# Altium schematic sheet pca10171_interface_mcu.SchDoc: =BoardTitle + ' - Interface MCU'
size A3; Organization: Nordic Semiconductor; DocumentNumber: 3; SheetNumber: 3; SheetTotal: 10; CompanyName: Nordic Semiconductor; DocumentSize: A3
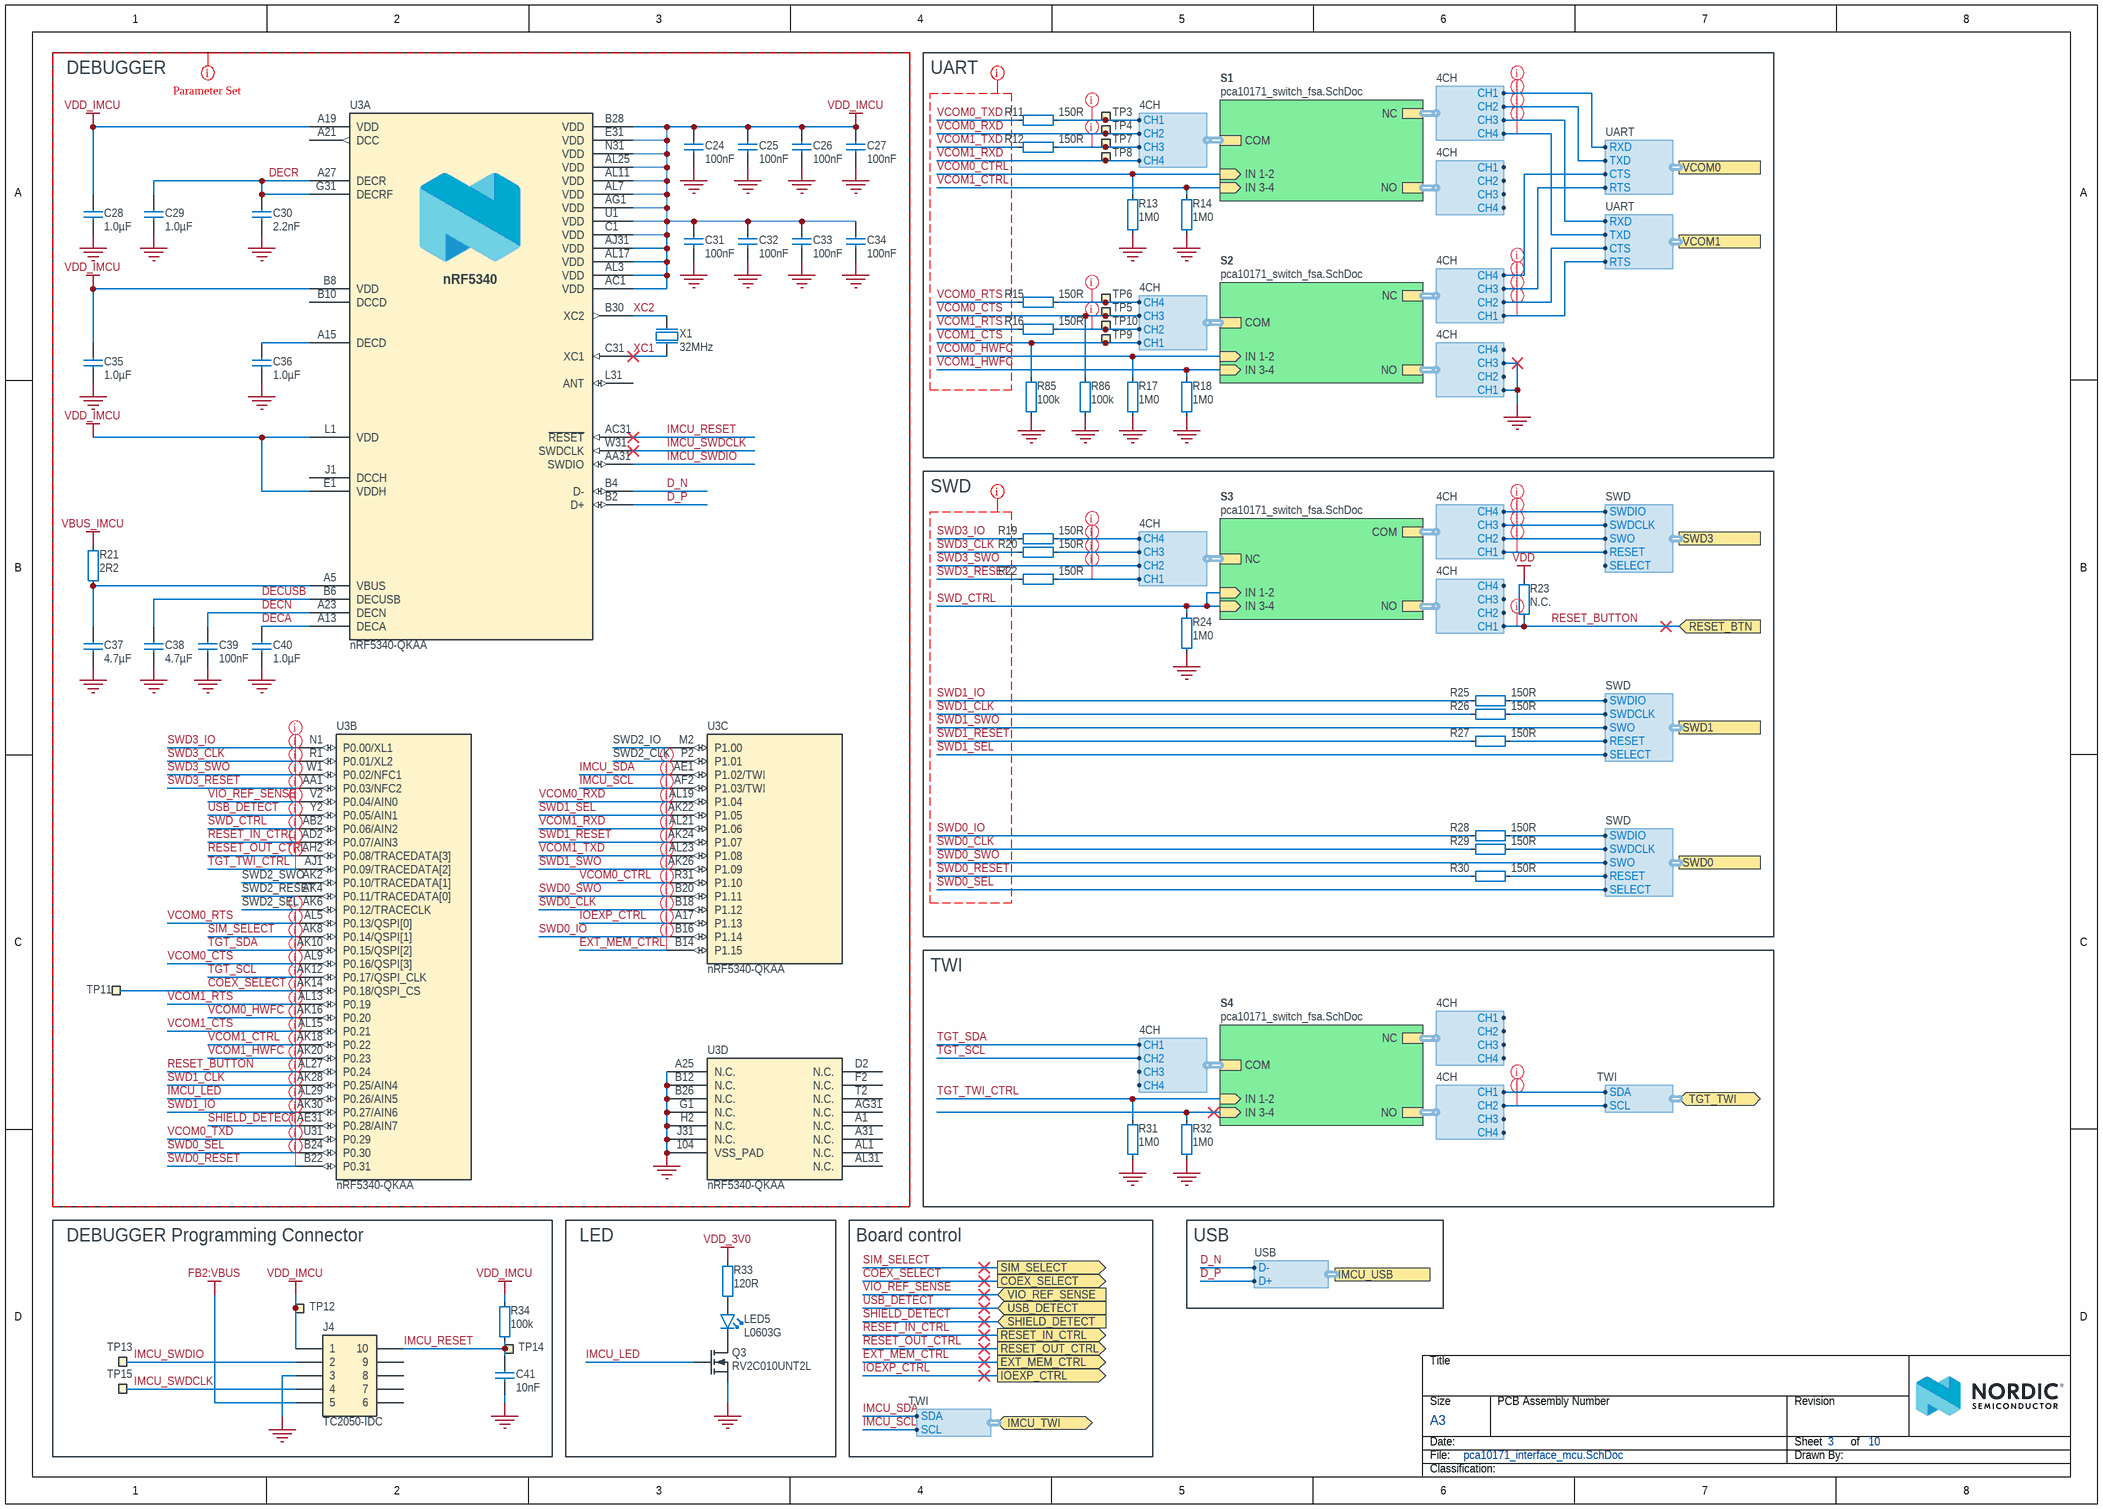
[diagram p0: pca10171_interface_mcu.SchDoc]

## Parts
C24  100nF  [CAPC0603X03L_C]
C25  100nF  [CAPC0603X03L_C]
C26  100nF  [CAPC0603X03L_C]
C27  100nF  [CAPC0603X03L_C]
C28  1.0µF  [CAPC1005X04L]
C29  1.0µF  [CAPC1005X04L]
C30  2.2nF  [CAPC0603X03L_C]
C31  100nF  [CAPC0603X03L_C]
C32  100nF  [CAPC0603X03L_C]
C33  100nF  [CAPC0603X03L_C]
C34  100nF  [CAPC0603X03L_C]
C35  1.0µF  [CAPC1005X04L]
C36  1.0µF  [CAPC1005X04L]
C37  4.7µF  [CAPC1608X06L]
C38  4.7µF  [CAPC1608X06L]
C39  100nF  [CAPC0603X03L_C]
C40  1.0µF  [CAPC1005X04L]
C41  10nF  [CAPC0603X03L_C]
J4  TC2050-IDC  [TC2050-IDC-NLFP]  (no BOM)
LED5  L0603G  [LED_0603_G]
Q3  RV2C010UNT2L  [DFN65P100X40-3L]
R11  150R  [RESC0603X03L_C]
R12  150R  [RESC0603X03L_C]
R13  1M0  [RESC0603X03L_C]
R14  1M0  [RESC0603X03L_C]
R15  150R  [RESC0603X03L_C]
R16  150R  [RESC0603X03L_C]
R17  1M0  [RESC0603X03L_C]
R18  1M0  [RESC0603X03L_C]
R19  150R  [RESC0603X03L_C]
R20  150R  [RESC0603X03L_C]
R21  2R2  [RESC0603X03L_C]
R22  150R  [RESC0603X03L_C]
R23  N.C.  [RESC0603X03L_C_NC]
R24  1M0  [RESC0603X03L_C]
R25  150R  [RESC0603X03L_C]
R26  150R  [RESC0603X03L_C]
R27  150R  [RESC0603X03L_C]
R28  150R  [RESC0603X03L_C]
R29  150R  [RESC0603X03L_C]
R30  150R  [RESC0603X03L_C]
R31  1M0  [RESC0603X03L_C]
R32  1M0  [RESC0603X03L_C]
R33  120R  [RESC0603X03L_C]
R34  100k  [RESC0603X03L_C]
R85  100k  [RESC0603X03L_C]
R86  100k  [RESC0603X03L_C]
TP3  Ø1.5mm,SMD  [TP_SMD_D1.5mm]  (value not drawn)  (no BOM)
TP4  Ø1.5mm,SMD  [TP_SMD_D1.5mm]  (value not drawn)  (no BOM)
TP5  Ø1.5mm,SMD  [TP_SMD_D1.5mm]  (value not drawn)  (no BOM)
TP6  Ø1.5mm,SMD  [TP_SMD_D1.5mm]  (value not drawn)  (no BOM)
TP7  Ø1.5mm,SMD  [TP_SMD_D1.5mm]  (value not drawn)  (no BOM)
TP8  Ø1.5mm,SMD  [TP_SMD_D1.5mm]  (value not drawn)  (no BOM)
TP9  Ø1.5mm,SMD  [TP_SMD_D1.5mm]  (value not drawn)  (no BOM)
TP10  Ø1.5mm,SMD  [TP_SMD_D1.5mm]  (value not drawn)  (no BOM)
TP11  Ø1.5mm,SMD  [TP_SMD_D1.5mm]  (value not drawn)  (no BOM)
TP12  Ø1.5mm,SMD  [TP_SMD_D1.5mm]  (value not drawn)  (no BOM)
TP13  Ø1.5mm,SMD  [TP_SMD_D1.5mm]  (value not drawn)  (no BOM)
TP14  Ø1.5mm,SMD  [TP_SMD_D1.5mm]  (value not drawn)  (no BOM)
TP15  Ø1.5mm,SMD  [TP_SMD_D1.5mm]  (value not drawn)  (no BOM)
U3  nRF5340-QKAA  [AQFN40P700X700X85_HS-99N]  (parts A,B,C,D of 4)
X1  32MHz  [BT-XTAL_2016]

## Blocks framed on the sheet
DEBUGGER: C24-C40 R21 TP11 U3 X1
UART: R11-R18 R85 R86 TP3-TP10
SWD: R19 R20 R22-R30
TWI: R31 R32
DEBUGGER Programming Connector: C41 J4 R34 TP12-TP15
LED: LED5 Q3 R33

## Sub-sheets
S1 = pca10171_switch_fsa.SchDoc: IN 1-2 (in), COM (harness 4CH), NC (harness 4CH), NO (harness 4CH), IN 3-4 (in)
S2 = pca10171_switch_fsa.SchDoc: IN 1-2 (in), COM (harness 4CH), NC (harness 4CH), NO (harness 4CH), IN 3-4 (in)
S3 = pca10171_switch_fsa.SchDoc: IN 1-2 (in), COM (harness 4CH), NC (harness 4CH), NO (harness 4CH), IN 3-4 (in)
S4 = pca10171_switch_fsa.SchDoc: IN 1-2 (in), COM (harness 4CH), NC (harness 4CH), NO (harness 4CH), IN 3-4 (in)

## Ports
COEX_SELECT (out), EXT_MEM_CTRL (out), IMCU_TWI (bidir, harness TWI), IMCU_USB (harness USB), IOEXP_CTRL (out), RESET_BTN (in), RESET_IN_CTRL (out), RESET_OUT_CTRL (out), SHIELD_DETECT (in), SIM_SELECT (out), SWD0 (harness SWD), SWD1 (harness SWD), SWD3 (harness SWD), TGT_TWI (bidir, harness TWI), USB_DETECT (in), VCOM0 (harness UART), VCOM1 (harness UART), VIO_REF_SENSE (in)

## Harnesses
TWI: SCL, SDA
SWD: SWDIO, SWDCLK, SWO, RESET, SELECT
USB: D+, D-
4CH: CH1, CH2, CH3, CH4
UART: RTS, CTS, RXD, TXD

## Nets
FB2:VBUS: J4.5
GND: C24.1 C25.1 C26.2 C27.1 C28.2 C29.1 C30.2 C31.1 C32.1 C33.1 C34.2 C35.1 C36.1 C37.2 C38.2 C39.2 C40.1 C41.1 J4.3 Q3.2(S) R13.2 R14.1 R17.2 R18.1 R24.1 R31.2 R32.1 R85.2 R86.2 U3.104(VSS_PAD) U3.A25(N.C.) U3.B12(N.C.) U3.B26(N.C.) U3.G1(N.C.) U3.H2(N.C.) U3.J31(N.C.) X1.2(GND) X1.4(GND) ; sheet S2/NO.CH1, sheet S2/NO.CH3
VBUS_IMCU: R21.1
VDD: R23.2
VDD_3V0: R33.2
VDD_IMCU: C24.2 C25.2 C26.1 C27.2 C28.1 C31.2 C32.2 C33.2 C34.1 C35.2 J4.1 R34.2 TP12.1 U3.A19(VDD) U3.AC1(VDD) U3.AG1(VDD) U3.AJ31(VDD) U3.AL3(VDD) U3.AL7(VDD) U3.AL11(VDD) U3.AL17(VDD) U3.AL25(VDD) U3.B8(VDD) U3.B28(VDD) U3.C1(VDD) U3.E1(VDDH) U3.E31(VDD) U3.L1(VDD) U3.N31(VDD) U3.U1(VDD)
COEX_SELECT: TP11.1 U3.AK14(P0.18/QSPI_CS) ; port COEX_SELECT
D_N: U3.B4(D-) ; port IMCU_USB.D-
D_P: U3.B2(D+) ; port IMCU_USB.D+
DECA: C40.2 U3.A13(DECA)
DECN: C39.1 U3.A23(DECN)
DECR: C29.2 C30.1 U3.A27(DECR) U3.G31(DECRF)
DECUSB: C38.1 U3.B6(DECUSB)
EXT_MEM_CTRL: U3.B14(P1.15) ; port EXT_MEM_CTRL
IMCU_LED: Q3.1(G) U3.AL29(P0.26/AIN5)
IMCU_RESET: C41.2 J4.10 R34.1 TP14.1 U3.AC31(~{RESET})
IMCU_SCL: U3.AF2(P1.03/TWI) ; port IMCU_TWI.SCL
IMCU_SDA: U3.AE1(P1.02/TWI) ; port IMCU_TWI.SDA
IMCU_SWDCLK: J4.4 TP15.1 U3.W31(SWDCLK)
IMCU_SWDIO: J4.2 TP13.1 U3.AA31(SWDIO)
IOEXP_CTRL: U3.A17(P1.13) ; port IOEXP_CTRL
RESET_BUTTON: R23.1 U3.AL27(P0.24) ; port RESET_BTN, sheet S3/NO.CH1
RESET_IN_CTRL: U3.AD2(P0.07/AIN3) ; port RESET_IN_CTRL
RESET_OUT_CTRL: U3.AH2(P0.08/TRACEDATA[3]) ; port RESET_OUT_CTRL
SHIELD_DETECT: U3.AE31(P0.28/AIN7) ; port SHIELD_DETECT
SIM_SELECT: U3.AK8(P0.14/QSPI[1]) ; port SIM_SELECT
SWD0_CLK: R29.1 U3.B18(P1.12)
SWD0_IO: R28.1 U3.B16(P1.14)
SWD0_RESET: R30.1 U3.B22(P0.31)
SWD0_SEL: U3.B24(P0.30) ; port SWD0.SELECT
SWD0_SWO: U3.B20(P1.11) ; port SWD0.SWO
SWD1_CLK: R26.1 U3.AK28(P0.25/AIN4)
SWD1_IO: R25.1 U3.AK30(P0.27/AIN6)
SWD1_RESET: R27.1 U3.AK24(P1.07)
SWD1_SEL: U3.AK22(P1.05) ; port SWD1.SELECT
SWD1_SWO: U3.AK26(P1.09) ; port SWD1.SWO
SWD3_CLK: R20.1 U3.R1(P0.01/XL2)
SWD3_IO: R19.1 U3.N1(P0.00/XL1)
SWD3_RESET: R22.1 U3.AA1(P0.03/NFC2)
SWD3_SWO: U3.W1(P0.02/NFC1) ; sheet S3/NC.CH2
SWD_CTRL: R24.2 U3.AB2(P0.06/AIN2) ; sheet S3/IN 1-2, sheet S3/IN 3-4
TGT_SCL: U3.AK12(P0.17/QSPI_CLK) ; sheet S4/COM.CH2
TGT_SDA: U3.AK10(P0.15/QSPI[2]) ; sheet S4/COM.CH1
TGT_TWI_CTRL: R31.1 U3.AJ1(P0.09/TRACEDATA[2]) ; sheet S4/IN 1-2
USB_DETECT: U3.Y2(P0.05/AIN1) ; port USB_DETECT
VCOM0_CTRL: R13.1 U3.R31(P1.10) ; sheet S1/IN 1-2
VCOM0_CTS: R86.1 TP5.1 U3.AL9(P0.16/QSPI[3]) ; sheet S2/COM.CH3
VCOM0_HWFC: R17.1 U3.AK16(P0.20) ; sheet S2/IN 1-2
VCOM0_RTS: R15.1 U3.AL5(P0.13/QSPI[0])
VCOM0_RXD: TP4.1 U3.AL19(P1.04) ; sheet S1/COM.CH2
VCOM0_TXD: R11.1 U3.U31(P0.29)
VCOM1_CTRL: R14.2 U3.AK18(P0.22) ; sheet S1/IN 3-4
VCOM1_CTS: R85.1 TP9.1 U3.AL15(P0.21) ; sheet S2/COM.CH1
VCOM1_HWFC: R18.2 U3.AK20(P0.23) ; sheet S2/IN 3-4
VCOM1_RTS: R16.1 U3.AL13(P0.19)
VCOM1_RXD: TP8.1 U3.AL21(P1.06) ; sheet S1/COM.CH4
VCOM1_TXD: R12.1 U3.AL23(P1.08)
VIO_REF_SENSE: U3.V2(P0.04/AIN0) ; port VIO_REF_SENSE
XC1: U3.C31(XC1) X1.1(inp)
XC2: U3.B30(XC2) X1.3(out)
NetC36_2: C36.2 U3.A15(DECD)
NetC37_1: C37.1 R21.2 U3.A5(VBUS)
NetLED5_1: LED5.1(C) Q3.3(D)
NetLED5_2: LED5.2(A) R33.1
NetR11_2: R11.2 TP3.1 ; sheet S1/COM.CH1
NetR12_2: R12.2 TP7.1 ; sheet S1/COM.CH3
NetR15_2: R15.2 TP6.1 ; sheet S2/COM.CH4
NetR16_2: R16.2 TP10.1 ; sheet S2/COM.CH2
NetR19_2: R19.2 ; sheet S3/NC.CH4
NetR20_2: R20.2 ; sheet S3/NC.CH3
NetR22_2: R22.2 ; sheet S3/NC.CH1
NetR25_2: R25.2 ; port SWD1.SWDIO
NetR26_2: R26.2 ; port SWD1.SWDCLK
NetR27_2: R27.2 ; port SWD1.RESET
NetR28_2: R28.2 ; port SWD0.SWDIO
NetR29_2: R29.2 ; port SWD0.SWDCLK
NetR30_2: R30.2 ; port SWD0.RESET
NetR32_2: R32.2 ; sheet S4/IN 3-4
(unnamed): sheet S1/NC.CH1, port VCOM0.RXD
(unnamed): sheet S1/NC.CH2, port VCOM0.TXD
(unnamed): sheet S1/NC.CH3, port VCOM1.RXD
(unnamed): sheet S1/NC.CH4, port VCOM1.TXD
(unnamed): port VCOM0.RTS, sheet S2/NC.CH3
(unnamed): port VCOM0.CTS, sheet S2/NC.CH4
(unnamed): port VCOM1.RTS, sheet S2/NC.CH1
(unnamed): port VCOM1.CTS, sheet S2/NC.CH2
(unnamed): sheet S3/COM.CH1, port SWD3.RESET
(unnamed): sheet S3/COM.CH2, port SWD3.SWO
(unnamed): sheet S3/COM.CH3, port SWD3.SWDCLK
(unnamed): sheet S3/COM.CH4, port SWD3.SWDIO
(unnamed): port TGT_TWI.SCL, sheet S4/NO.CH2
(unnamed): port TGT_TWI.SDA, sheet S4/NO.CH1

Not connected (* = marked no-connect by the designer): J4 6 7 8 9; U3 A1(N.C.) A21(DCC) A31(N.C.) AG31(N.C.) AK2(P0.10/TRACEDATA[1]) AK4(P0.11/TRACEDATA[0]) AK6(P0.12/TRACECLK) AL1(N.C.) AL31(N.C.) B10(DCCD) D2(N.C.) F2(N.C.) J1(DCCH) L31(ANT) M2(P1.00) P2(P1.01) T2(N.C.)

## Layout directives
net class GPIO: (no net found under the mark), COEX_SELECT, EXT_MEM_CTRL, IMCU_LED, IMCU_SCL, IMCU_SDA, IOEXP_CTRL, NetR11_2, NetR12_2, NetR15_2, NetR16_2, NetR19_2, NetR20_2, NetR22_2, RESET_BUTTON, RESET_IN_CTRL, RESET_OUT_CTRL, SHIELD_DETECT, SIM_SELECT, SWD0_CLK, SWD0_IO, SWD0_RESET, SWD0_SEL, SWD0_SWO, SWD1_CLK, SWD1_IO, SWD1_RESET, SWD1_SEL, SWD1_SWO, SWD3_CLK, SWD3_IO, SWD3_RESET, SWD3_SWO, SWD_CTRL, TGT_SCL, TGT_SDA, TGT_TWI_CTRL, USB_DETECT, VCOM0_CTRL, VCOM0_CTS, VCOM0_HWFC, VCOM0_RTS, VCOM0_RXD, VCOM0_TXD, VCOM1_CTRL, VCOM1_CTS, VCOM1_HWFC, VCOM1_RTS, VCOM1_RXD, VCOM1_TXD, VIO_REF_SENSE
CompClassName: IMCU: COEX_SELECT, D_N, D_P, DECA, DECN, DECR, DECUSB, EXT_MEM_CTRL, GND, IMCU_LED, IMCU_RESET, IMCU_SCL, IMCU_SDA, IMCU_SWDCLK, IMCU_SWDIO, IOEXP_CTRL, RESET_BUTTON, RESET_IN_CTRL, RESET_OUT_CTRL, SHIELD_DETECT, SIM_SELECT, SWD0_CLK, SWD0_IO, SWD0_RESET, SWD0_SEL, SWD0_SWO, SWD1_CLK, SWD1_IO, SWD1_RESET, SWD1_SEL, SWD1_SWO, SWD3_CLK, SWD3_IO, SWD3_RESET, SWD3_SWO, SWD_CTRL, TGT_SCL, TGT_SDA, TGT_TWI_CTRL, USB_DETECT, VBUS_IMCU, VCOM0_CTRL, VCOM0_CTS, VCOM0_HWFC, VCOM0_RTS, VCOM0_RXD, VCOM0_TXD, VCOM1_CTRL, VCOM1_CTS, VCOM1_HWFC, VCOM1_RTS, VCOM1_RXD, VCOM1_TXD, VDD_IMCU, VIO_REF_SENSE, XC1, XC2
net class VCOM: VCOM0_CTRL, VCOM0_CTS, VCOM0_HWFC, VCOM0_RTS, VCOM0_RXD, VCOM0_TXD, VCOM1_CTRL, VCOM1_CTS, VCOM1_HWFC, VCOM1_RTS, VCOM1_RXD, VCOM1_TXD
net class SWD: SWD0_CLK, SWD0_IO, SWD0_RESET, SWD0_SEL, SWD0_SWO, SWD1_CLK, SWD1_IO, SWD1_RESET, SWD1_SEL, SWD1_SWO, SWD3_CLK, SWD3_IO, SWD3_RESET, SWD3_SWO, SWD_CTRL

## Notes on the sheet
- (near U3) SWD2_IO
- (near U3) SWD2_CLK
- (near U3) SWD2_SWO
- (near U3) SWD2_RESET
- (near U3) SWD2_SEL
- Board control
- USB
- Title
- Size
- Date:
- File:
- A3
- PCB Assembly Number
- Sheet         of
- Drawn By:
- Revision
- Classification:
- (in symbol nRF5340-QKAAD0, part A) nRF5340

## Library data of the parts
C24-C27 C31-C33 = C0201-100n: Capacitor, X5R, ±10%; Manufacturer: N.A.; Part number IPS: 00000001248, 00000002505; Part number Norautron: 262071862; Part number NEMS: 100200078; Note: 16V; Pad Count: 2; Component Status: Active; Part Number: C0201-100n; Manufacturer Part Number: N.A.; ComponentLink1URL: N.A.; ComponentLink1Description: Datasheet; ComponentLink2URL: N.A.; ComponentLink2Description: Supplier link; HelpURL: N.A.; Footprint Doc: 0201; LatestRevisionDate: 2017-11-09; Published: 2014-11-13; Value: 100nF; Artikkelnr Noca: N.A.; Supplier 1: N.A.; Supplier Part Number 1: N.A.; Supplier 2: N.A.; Supplier Part Number 2: N.A.; PartId: 100200078; Component Class: Capacitors; Author: rsk
C28 C29 C35 C36 C40 = C0402-1µ0-10V-X5R: Capacitor, Ceramic, X5R, ±10%, 10V; Manufacturer: N.A.; Part number NEMS: 100200482; Pad Count: 2; Component Status: Active; Part Number: C0402-1µ0-10V-X5R; Value: 1.0µF; Footprint Doc: 0402; Component Class: Capacitors; Author: rubr; PartId: 100200482; Manufacturer Part Number: N.A.; ComponentLink1URL: N.A.; ComponentLink1Description: Datasheet; ComponentLink2URL: N.A.; ComponentLink2Description: Supplier link; HelpURL: N.A.; LatestRevisionDate: 2021-07-22; Published: 2021-07-22; Note: 10V; Supplier 1: N.A.; Supplier Part Number 1: N.A.; Supplier 2: N.A.; Supplier Part Number 2: N.A.; Artikkelnr Noca: N.A.; Part number IPS: N.A.; Part number Norautron: N.A.
C30 = C0201-2n2: Capacitor, X7R, ±10%, 10V; Manufacturer: N.A.; Part number IPS: 00000001778; Part number Norautron: 26470002; Part number NEMS: 100200060; Pad Count: 2; Component Status: Active; Part Number: C0201-2n2; Value: 2.2nF; Footprint Doc: 0201; Component Class: Capacitors; Author: rsk; PartId: 100200060; Manufacturer Part Number: N.A.; ComponentLink1URL: N.A.; ComponentLink1Description: Datasheet; ComponentLink2URL: N.A.; ComponentLink2Description: Supplier link; HelpURL: N.A.; LatestRevisionDate: 2014-11-13; Published: 2014-11-13; Note: 10V; Supplier 1: N.A.; Supplier Part Number 1: N.A.; Supplier 2: N.A.; Supplier Part Number 2: N.A.; Artikkelnr Noca: N.A.
C34 C39 = C0201-100n: Capacitor, X5R, ±10%; Manufacturer: N.A.; Part number IPS: 00000001248, 00000002505; Part number Norautron: 262071862; Part number NEMS: 100200078; Pad Count: 2; Note: 16V; Component Status: Active; Part Number: C0201-100n; Value: 100nF; Footprint Doc: 0201; Component Class: Capacitors; Author: rsk; PartId: 100200078; Manufacturer Part Number: N.A.; ComponentLink1URL: N.A.; ComponentLink1Description: Datasheet; ComponentLink2URL: N.A.; ComponentLink2Description: Supplier link; HelpURL: N.A.; LatestRevisionDate: 2017-11-09; Published: 2014-11-13; Supplier 1: N.A.; Supplier Part Number 1: N.A.; Supplier 2: N.A.; Supplier Part Number 2: N.A.; Artikkelnr Noca: N.A.
C37 C38 = C0603-4µ7-10V-X5R: Capacitor, Ceramic, X5R, ±10%, 10V; Manufacturer: N.A.; Part number Norautron: 262081761; Part number NEMS: 100200479; Pad Count: 2; Component Status: Active; Part Number: C0603-4µ7-10V-X5R; Manufacturer Part Number: N.A.; ComponentLink1URL: N.A.; ComponentLink1Description: Datasheet; ComponentLink2URL: N.A.; ComponentLink2Description: Supplier link; HelpURL: N.A.; Footprint Doc: 0603; LatestRevisionDate: 2021-07-22; Published: 2021-07-22; Value: 4.7µF; Note: 10V; Artikkelnr Noca: N.A.; Part number IPS: N.A.; Supplier 1: N.A.; Supplier Part Number 1: N.A.; Supplier 2: N.A.; Supplier Part Number 2: N.A.; PartId: 100200479; Component Class: Capacitors; Author: rubr
C41 = C0201-10n: Capacitor, X7R, ±10%; Manufacturer: N.A.; Part number IPS: 00000003480; Part number Norautron: 26621779; Part number NEMS: 100200067; Note: 10V; Pad Count: 2; Component Status: Active; Part Number: C0201-10n; Manufacturer Part Number: N.A.; ComponentLink1URL: N.A.; ComponentLink1Description: Datasheet; ComponentLink2URL: N.A.; ComponentLink2Description: Supplier link; HelpURL: N.A.; Footprint Doc: 0201; LatestRevisionDate: 2017-11-09; Published: 2014-11-13; Value: 10nF; Supplier 1: N.A.; Supplier Part Number 1: N.A.; Supplier 2: N.A.; Supplier Part Number 2: N.A.; Artikkelnr Noca: N.A.; PartId: 100200067; Component Class: Capacitors; Author: rsk
J4 = TC2050-IDC-NLFP: CBL PLUG-OF-NAILS 10-PIN; Manufacturer: Tag-Connect LLC; Part number NEMS: 100500463; Artikkelnr Noca: N.A.; Pad Count: 10; Component Status: Active; System: Connector; Part Number: TC2050-IDC-NLFP; Manufacturer Part Number: TC2050-IDC-NLFP; LatestRevisionDate: 2012-11-21; Published: 2012-11-21; Value: TC2050-IDC; Footprint Doc: TC2050-IDC-NLFP; Part number IPS: N.A.; ComponentLink1URL: N.A.; ComponentLink1Description: Datasheet; ComponentLink2URL: N.A.; ComponentLink2Description: Supplier link; HelpURL: http://www.tag-connect.com/Materials/TC2050-IDC%20Datasheet.pdf; Supplier 1: Digi-Key; Supplier Part Number 1: TC2050-IDC-NL-ND; Supplier 2: N.A.; Supplier Part Number 2: N.A.; PartId: 100500463; Component Class: Connectors; Note: N.A.; Author: rsk; Part number Norautron: N.A.
LED5 = VS 25C7M5: LED, Green, 0603, 573nm, Vf=2.0V, 24mcd, - 40 to +85°C; Manufacturer: Victory Electronics; Part number IPS: 00000001274, 00000009961; Part number Norautron: 26313411; Part number NEMS: 101400097; Note: N.A.; Artikkelnr Noca: 13019193; Pad Count: 2; Component Status: Active; Part Number: VS 25C7M5; Manufacturer Part Number: VS 25C7M5; Footprint Doc: 0603; LatestRevisionDate: 2020-10-23; Published: 2017-08-21; Value: L0603G; ComponentLink1URL: N.A.; ComponentLink1Description: Datasheet; ComponentLink2URL: N.A.; ComponentLink2Description: Supplier link; HelpURL: \\hizz\pro\app9717\Datasheet\optoelectronics\Victory Electronics\VS 25C7M5.pdf; Supplier 1: EC Partner; Supplier Part Number 1: N.A.; Supplier 2: N.A.; Supplier Part Number 2: N.A.; PartId: 101400097; Component Class: Optoelectronics; Author: rsk
Q3 = RV2C010UNT2L: N-Channel MOSFET, 20V, 1A, 470mOhm, 400mW; Manufacturer: Rohm Semiconductor; Part number IPS: 00000009976; Part number Norautron: 26320026; Part number NEMS: 101300132; Note: N.A.; Artikkelnr Noca: 35010020; Pad Count: 3; Component Status: Active; Part Number: RV2C010UNT2L; Manufacturer Part Number: RV2C010UNT2L; ComponentLink1URL: N.A.; ComponentLink1Description: Datasheet; ComponentLink2URL: N.A.; ComponentLink2Description: Supplier link; HelpURL: http://rohmfs.rohm.com/en/products/databook/datasheet/discrete/transistor/mosfet/rv2c010unt2l-e.pdf; Footprint Doc: DFN-3; LatestRevisionDate: 2016-08-09; Published: 2016-08-09; Value: RV2C010UNT2L; Supplier 1: Digi-Key; Supplier Part Number 1: RV2C010UNT2LCT-ND; Supplier 2: Mouser; Supplier Part Number 2: 755-RV2C010UNT2L; PartId: 101300132; Component Class: Semiconductors; Author: rsk
R11 R12 R15 R16 R19 R20 R22 R25-R30 = R0201-150: Resistor, ±1%, 0.05W; Manufacturer: N.A.; Part number IPS: 00000001420; Part number NEMS: 100100029; Note: Chip Res 1%; Pad Count: 2; Component Status: Active; Part Number: R0201-150; Manufacturer Part Number: N.A.; ComponentLink1URL: N.A.; ComponentLink1Description: Datasheet; ComponentLink2URL: N.A.; ComponentLink2Description: Supplier link; HelpURL: N.A.; Footprint Doc: 0201; LatestRevisionDate: 2014-11-13; Published: 2014-11-13; Value: 150R; Artikkelnr Noca: N.A.; Supplier 1: N.A.; Supplier Part Number 1: N.A.; Supplier 2: N.A.; Supplier Part Number 2: N.A.; PartId: 100100029; Component Class: Resistors; Author: rsk; Part number Norautron: N.A.
R13 R14 R17 R18 R24 R31 R32 = R0201-1M0: Resistor, ±1%, 0.05W; Manufacturer: N.A.; Part number IPS: 00000001418; Part number Norautron: 26107108; Part number NEMS: 100100093; Note: Chip Res 1%; Pad Count: 2; Component Status: Active; Part Number: R0201-1M0; Manufacturer Part Number: N.A.; ComponentLink1URL: N.A.; ComponentLink1Description: Datasheet; ComponentLink2URL: N.A.; ComponentLink2Description: Supplier link; HelpURL: N.A.; Footprint Doc: 0201; LatestRevisionDate: 2014-11-13; Published: 2014-11-13; Value: 1M0; Artikkelnr Noca: N.A.; Supplier 1: N.A.; Supplier Part Number 1: N.A.; Supplier 2: N.A.; Supplier Part Number 2: N.A.; PartId: 100100093; Component Class: Resistors; Author: rsk
R21 = R0201-2R2: Resistor, ±1%, 0.05W; Manufacturer: N.A.; Part number Norautron: 26470029; Part number NEMS: 100100006; Pad Count: 2; Note: Chip Res 1%; Component Status: Active; Part Number: R0201-2R2; Footprint Doc: 0201; Value: 2R2; Component Class: Resistors; Author: rsk; PartId: 100100006; Manufacturer Part Number: N.A.; ComponentLink1URL: N.A.; ComponentLink1Description: Datasheet; ComponentLink2URL: N.A.; ComponentLink2Description: Supplier link; HelpURL: N.A.; LatestRevisionDate: 2014-11-13; Published: 2014-11-13; Supplier 1: N.A.; Supplier Part Number 1: N.A.; Supplier 2: N.A.; Supplier Part Number 2: N.A.; Artikkelnr Noca: N.A.; Part number IPS: N.A.
R23 = R0201-N.C.: Not mounted; Manufacturer: N.A.; Part number NEMS: 100100107; Note: Chip Res; Assembly: Not mounted; Pad Count: 2; Component Status: Active; Part Number: R0201-N.C.; Manufacturer Part Number: N.A.; Footprint Doc: 0201; LatestRevisionDate: 2014-11-13; Published: 2014-11-13; Value: N.C.; Artikkelnr Noca: N.A.; Part number IPS: N.A.; ComponentLink1URL: N.A.; ComponentLink1Description: Datasheet; ComponentLink2URL: N.A.; ComponentLink2Description: Supplier link; HelpURL: N.A.; Supplier 1: N.A.; Supplier Part Number 1: N.A.; Supplier 2: N.A.; Supplier Part Number 2: N.A.; Author: rsk; Component Class: Resistors; PartId: 100100107; Part number Norautron: N.A.
R33 = R0201-120: Resistor, ±1%, 0.05W; Manufacturer: N.A.; Part number IPS: 00000000880; Part number Norautron: 26107076; Part number NEMS: 100100028; Note: Chip Res 1%; Pad Count: 2; Component Status: Active; Part Number: R0201-120; Manufacturer Part Number: N.A.; ComponentLink1URL: N.A.; ComponentLink1Description: Datasheet; ComponentLink2URL: N.A.; ComponentLink2Description: Supplier link; HelpURL: N.A.; Footprint Doc: 0201; LatestRevisionDate: 2014-11-13; Published: 2014-11-13; Value: 120R; Supplier 1: N.A.; Supplier Part Number 1: N.A.; Supplier 2: N.A.; Supplier Part Number 2: N.A.; Artikkelnr Noca: N.A.; PartId: 100100028; Component Class: Resistors; Author: rsk
R34 R85 R86 = R0201-100k: Resistor, ±1%, 0.05W; Manufacturer: N.A.; Part number IPS: 00000001419; Part number Norautron: 26108487; Part number NEMS: 100100080; Note: Chip Res 1%; Pad Count: 2; Component Status: Active; Part Number: R0201-100k; Manufacturer Part Number: N.A.; ComponentLink1URL: N.A.; ComponentLink1Description: Datasheet; ComponentLink2URL: N.A.; ComponentLink2Description: Supplier link; HelpURL: N.A.; Footprint Doc: 0201; LatestRevisionDate: 2014-11-13; Published: 2014-11-13; Value: 100k; Artikkelnr Noca: N.A.; Supplier 1: N.A.; Supplier Part Number 1: N.A.; Supplier 2: N.A.; Supplier Part Number 2: N.A.; PartId: 100100080; Component Class: Resistors; Author: rsk
TP3-TP15 = TP_SMD_Ø1.5MM: 1.5mm circular SMD testpad; Manufacturer: Nordic Semiconductor; Manufacturer Part Number: N.A.; Part number NEMS: 100500477; Pad Count: 1; Component Status: Active; Part Number: TP_SMD_Ø1.5MM; LatestRevisionDate: 2021-03-05; Published: 2016-06-02; Value: Ø1.5mm,SMD; Note: N.A.; Artikkelnr Noca: N.A.; Footprint Doc: TP_SMD_Ø1.5mm; Part number IPS: N.A.; ComponentLink1URL: N.A.; ComponentLink1Description: Datasheet; ComponentLink2URL: N.A.; ComponentLink2Description: Supplier link; HelpURL: N.A.; Supplier 1: N.A.; Supplier Part Number 1: N.A.; Supplier 2: N.A.; Supplier Part Number 2: N.A.; PartId: 100500477; Component Class: Connectors; Author: rsk; Part number Norautron: N.A.
U3 = nRF5340-QKAAD0: Multi-protocol Bluetooth Low Energy, IEEE 802.15.4, ANT and 2.4GHz proprietary system-on-chip; Manufacturer: Nordic Semiconductor; Part number Norautron: NOD26470035; Part number NEMS: 102000216; Pad Count: 98; Note: N.A.; Component Status: Active; Part Number: nRF5340-QKAAD0; PartId: 102000216; Component Class: Nordic_Devices; Author: rsk; Manufacturer Part Number: nRF5340-QKAAD0; ComponentLink1URL: N.A.; ComponentLink1Description: Datasheet; ComponentLink2URL: N.A.; ComponentLink2Description: Supplier link; HelpURL: N.A.; Footprint Doc: AQFN-98; LatestRevisionDate: 2020-12-02; Published: 2020-12-02; Value: nRF5340-QKAA; Supplier 1: Nordic Semiconductor; Supplier Part Number 1: nRF5340-QKAAD0; Supplier 2: N.A.; Supplier Part Number 2: N.A.; Artikkelnr Noca: N.A.; Part number IPS: N.A.
X1 = XTAL_SMD2016_32MHz_8pF_Kyocera: XTAL SMD 2016, 32MHz, Cl=8pF, Tot: ±40ppm; Manufacturer Part Number: CX2016DB32000D0WZRC1; Part number IPS: 00000007827; Part number Norautron: 26511136; Part number NEMS: 101600039; Pad Count: 4; Note: XTAL SMD 32.000MHz; Artikkelnr Noca: 22010022; Component Status: Active; Part Number: XTAL_SMD2016_32MHz_8pF_Kyocera; Value: 32MHz; Footprint Doc: XTAL_2016; Component Class: Oscillators; Author: rsk; PartId: 101600039; Manufacturer: Kyocera; ComponentLink1URL: N.A.; ComponentLink1Description: Datasheet; ComponentLink2URL: N.A.; ComponentLink2Description: Supplier link; HelpURL: http://media.digikey.com/pdf/Data%20Sheets/AVX%20PDFs/CX2016DB32000D0WZRC1_Spec.pdf; LatestRevisionDate: 2016-06-02; Published: 2015-10-15; Supplier 1: Digi-Key; Supplier Part Number 1: 1253-1586-1-ND; Supplier 2: N.A.; Supplier Part Number 2: N.A.